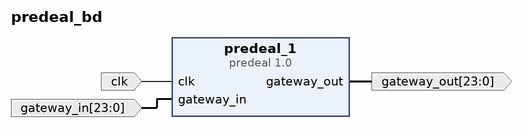
[diagram p0: block diagram of the top level]
# Vivado block design predeal_bd, xc7z010clg400-2, Vivado 2018.3
create_bd_design predeal_bd

create_bd_port -dir I -type clk clk
create_bd_port -dir I -from 23 -to 0 -type data gateway_in
create_bd_port -dir O -from 23 -to 0 -type data gateway_out

create_bd_cell -type ip -vlnv User_Company:SysGen:predeal:1.0 predeal_1

# ---- connections ----

connect_bd_net [get_bd_ports clk] [get_bd_pins predeal_1/clk]
connect_bd_net [get_bd_ports gateway_in] [get_bd_pins predeal_1/gateway_in]
connect_bd_net [get_bd_pins predeal_1/gateway_out] [get_bd_ports gateway_out]

validate_bd_design
save_bd_design
